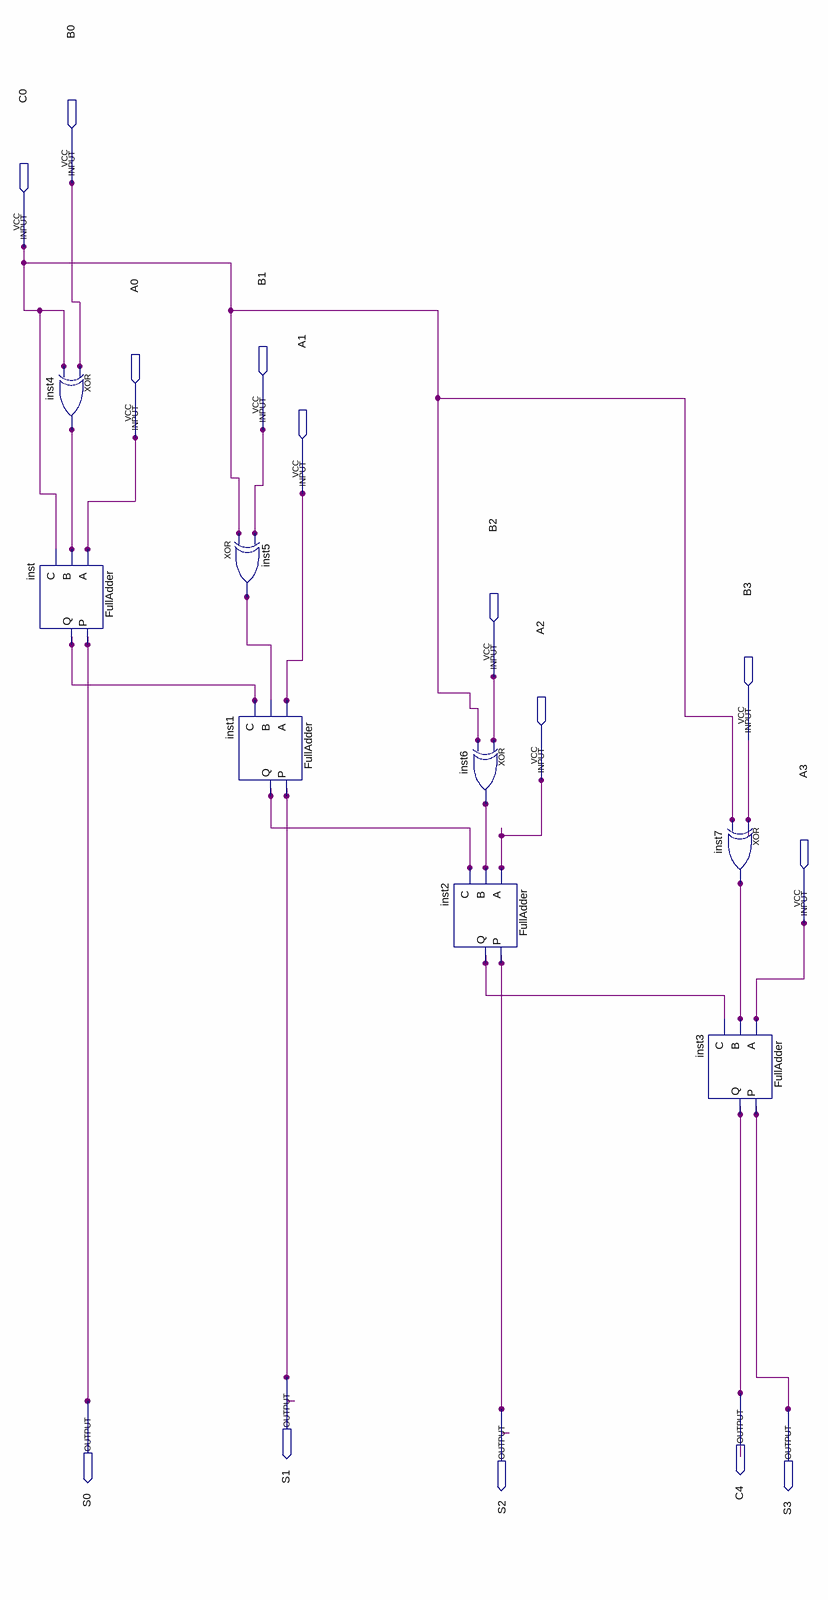
[diagram p0: schematic sheet]
// Quartus schematic AdderSubtractor.bdf as structural Verilog: 8 symbols, 14 pins
module AdderSubtractor (
  input  B0,
  input  C0,
  input  B1,
  input  A0,
  input  A1,
  input  B2,
  input  B3,
  input  A2,
  input  A3,
  output S1,
  output C4,
  output S0,
  output S2,
  output S3
);

  wire inst1_q, inst2_q, inst4_out, inst5_out, inst6_out, inst7_out, inst_q;

  xor inst4 (inst4_out, B0, C0);
  FullAdder inst (.A(A0), .B(inst4_out), .C(C0), .P(S0), .Q(inst_q));
  xor inst5 (inst5_out, C0, B1);
  FullAdder inst1 (.A(A1), .B(inst5_out), .C(inst_q), .P(S1), .Q(inst1_q));
  FullAdder inst2 (.A(A2), .B(inst6_out), .C(inst1_q), .P(S2), .Q(inst2_q));
  xor inst6 (inst6_out, B2, C0);
  FullAdder inst3 (.A(A3), .B(inst7_out), .C(inst2_q), .P(S3), .Q(C4));
  xor inst7 (inst7_out, B3, C0);
endmodule
